# EasyEDA schematic SCH_CentralkaPawela-1.3_2025-06-29.json
TITLE: Sheet_1; REV: 1.0; Date: 2024-12-18; Sheet: 1/1; Drawn By: MarcinanBarbarzynca; Company: Your Company
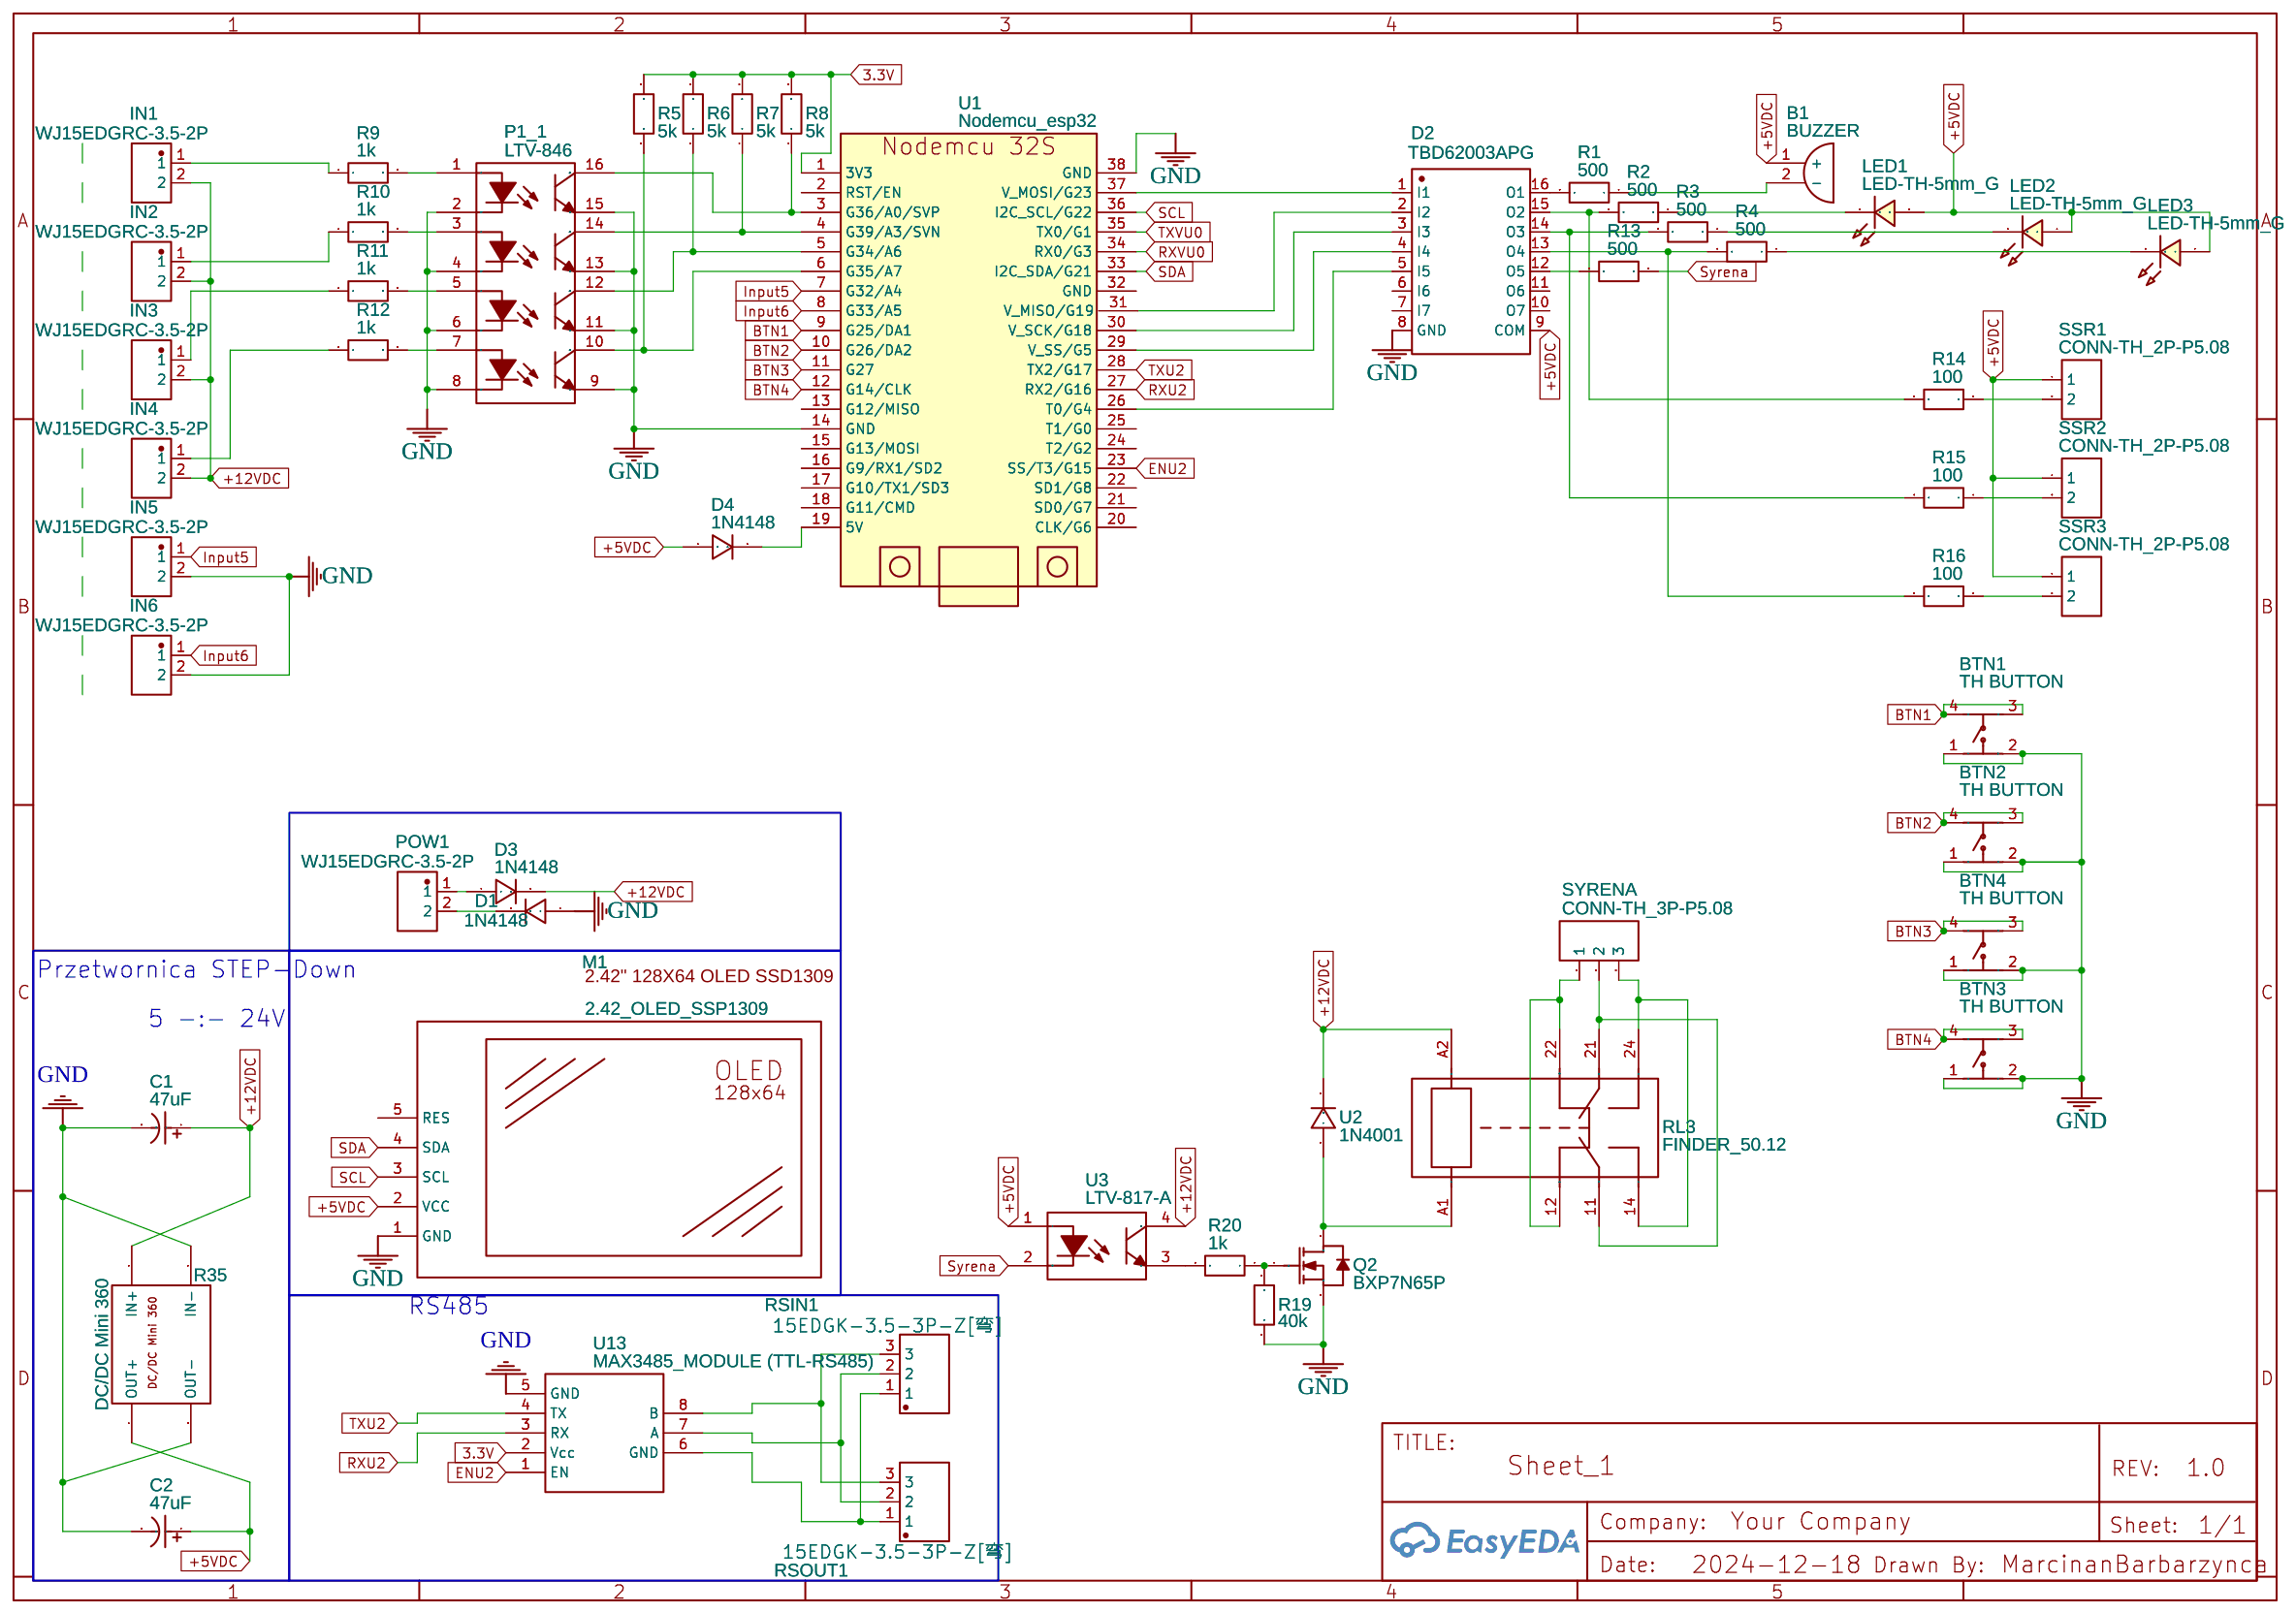
[diagram p0: schematic sheet]

## Parts
B1  BUZZER  [BUZZER]
BTN1  TH BUTTON  [KEY-TH_4P-L6.0-W6.0-P4.50-LS7.5]
BTN2  TH BUTTON  [KEY-TH_4P-L6.0-W6.0-P4.50-LS7.5]
BTN3  TH BUTTON  [KEY-TH_4P-L6.0-W6.0-P4.50-LS7.5]
BTN4  TH BUTTON  [KEY-TH_4P-L6.0-W6.0-P4.50-LS7.5]
C1  47uF  [CAP-D5.0XF2.0]
C2  47uF  [CAP-D5.0XF2.0]
D1  1N4148  [DO-35_BD2.0-L4.0-P8.00-D0.5-FD]
D2  TBD62003APG  [DIP-16_L19.8-W6.5-P2.54-LS7.6-BL]
D3  1N4148  [DO-35_BD2.0-L4.0-P8.00-D0.5-FD]
D4  1N4148  [DO-35_BD2.0-L4.0-P8.00-D0.5-FD]
IN1  WJ15EDGRC-3.5-2P  [CONN-TH_2P-P3.50_WJ15EDGRC-3.5-2P]
IN2  WJ15EDGRC-3.5-2P  [CONN-TH_2P-P3.50_WJ15EDGRC-3.5-2P]
IN3  WJ15EDGRC-3.5-2P  [CONN-TH_2P-P3.50_WJ15EDGRC-3.5-2P]
IN4  WJ15EDGRC-3.5-2P  [CONN-TH_2P-P3.50_WJ15EDGRC-3.5-2P]
IN5  WJ15EDGRC-3.5-2P  [CONN-TH_2P-P3.50_WJ15EDGRC-3.5-2P]
IN6  WJ15EDGRC-3.5-2P  [CONN-TH_2P-P3.50_WJ15EDGRC-3.5-2P]
LED1  LED-TH-5mm_G  [LED-TH_BD5.0_GREEN]
LED2  LED-TH-5mm_G  [LED-TH_BD5.0_GREEN]
LED3  LED-TH-5mm_G  [LED-TH_BD5.0_GREEN]
M1  2.42_OLED_SSP1309  [2.42_OLED_SSD1309]
P1_1  LTV-846  [DIP-16_16P-L20.2-W6.6-P2.54-LS7.6-BL]
POW1  WJ15EDGRC-3.5-2P  [CONN-TH_2P-P3.50_WJ15EDGRC-3.5-2P]
Q2  BXP7N65P  [PG-TO220-3_L10.0-W4.5-P2.54-L]
R1  500  [R_AXIAL-0.3]
R2  500  [R_AXIAL-0.3]
R3  500  [R_AXIAL-0.3]
R4  500  [R_AXIAL-0.3]
R5  5k  [R_AXIAL-0.3]
R6  5k  [R_AXIAL-0.3]
R7  5k  [R_AXIAL-0.3]
R8  5k  [R_AXIAL-0.3]
R9  1k  [R_AXIAL-0.3]
R10  1k  [R_AXIAL-0.3]
R11  1k  [R_AXIAL-0.3]
R12  1k  [R_AXIAL-0.3]
R13  500  [R_AXIAL-0.3]
R14  100  [R_AXIAL-0.3]
R15  100  [R_AXIAL-0.3]
R16  100  [R_AXIAL-0.3]
R19  40k  [R_AXIAL-0.3]
R20  1k  [R_AXIAL-0.3]
R35  DC/DC Mini 360  [DC/DC MINI 360]
RL3  FINDER_50.12  [FINDER-40.52]
RSIN1  15EDGK-3.5-3P-Z[弯]  [CONN-TH_3P-P3.50_WJ15EDGRC-3.5-3P-14-00A]
RSOUT1  15EDGK-3.5-3P-Z[弯]  [CONN-TH_3P-P3.50_WJ15EDGRC-3.5-3P-14-00A]
SSR1  CONN-TH_2P-P5.08  [CONN-TH_2P-P5.08]
SSR2  CONN-TH_2P-P5.08  [CONN-TH_2P-P5.08]
SSR3  CONN-TH_2P-P5.08  [CONN-TH_2P-P5.08]
SYRENA  CONN-TH_3P-P5.08  [CONN-TH_3P-P5.08]
U1  Nodemcu_esp32  [NODEMCU-ESP32S]
U2  1N4001  [DO-41_BD2.6-L5.1-P9.00-D0.8-RD]
U3  LTV-817-A  [DIP-4_L4.6-W6.5-P2.54-LS7.6-BL]
U13  MAX3485_MODULE (TTL-RS485)  [MAX3485_MODULE (TTL-RS485)]

## Library data of the parts
B1 = BUZZER: Buzzer; sourceId: 6mRnFXf9r; Contributor: Setthaphan
BTN1-BTN4 = TH BUTTON: Supplier Part: C59982; Supplier: LCSC; Manufacturer: ReliaPro; Manufacturer Part: button6*6*8; JLCPCB Part Class: Extended Part
C1 C2 = 47uF 16V Aluminum electrolytic capacitors: Supplier: LCSC; Manufacturer: ValuePro; Supplier Part: C22320
D1 D3 D4 = 1N4148: Supplier: LCSC; Manufacturer: SEMTECH; Supplier Part: C14516; Contributor: LCEDA_Lib
D2 = TBD62003APG: Supplier: LCSC; Manufacturer: TOSHIBA; Contributor: LCSC; Supplier Part: C146373
IN1-IN6 POW1 = WJ15EDGRC-3.5-2P: Contributor: LCSC; Supplier: LCSC; Supplier Part: C2924837; Manufacturer: KANGNEX(康奈克斯电气); JLCPCB Part Class: Extended Part
LED1-LED3 = LED-TH-5mm_G: Manufacturer: EVERLIGHT(台湾亿光); Manufacturer Part: 333-2SYGD/S530-E2; Supplier Part: C88163; Supplier: LCSC; Contributor: LCEDA_Lib
M1 = 2.42_OLED_SSP1309: Supplier: Nettigo; Contributor: Lberquez
P1_1 = LTV-846: Supplier: LCSC; Manufacturer: LITEON; Supplier Part: C10793
Q2 = IPP60R385CP: Contributor: LCSC; Supplier: LCSC; Supplier Part: C537223; Manufacturer: Infineon(英飞凌); JLCPCB Part Class: Extended Part
R1-R16 R19 R20 = R_AXIAL-0.3_EU: Contributor: LCEDA_Lib
R35 = DC/DC Mini 360: Contributor: marcos.asael2
RL3 = FINDER_40.52.7.012.0000: Manufacturer Part: New SchematicLib; Contributor: jlam123; Supplier Part: 40.61.7.012.0000; Supplier: Pollin; link: https://www.pollin.de/p/relais-finder-40-61-7-012-0000-340678
RSIN1 RSOUT1 = 15EDGK-3.5-3P-Z[弯]: Contributor: LCSC; Supplier: LCSC; Supplier Part: C9900003720; Manufacturer: null; JLCPCB Part Class: Extended Part
SSR1-SSR3 = CONN-TH_2P-P5.08: Supplier: LCSC; Contributor: LCEDA_Lib
SYRENA = CONN-TH_3P-P5.08: Supplier: LCSC; Contributor: LCEDA_Lib
U1 = Nodemcu_esp32: Manufacturer Part: Nodemcu esp32; Contributor: Pietro Dona
U2 = 1N4001_C237252: Contributor: lcsc; Supplier: LCSC; Supplier Part: C237252; Manufacturer: HL(豪林); JLCPCB Part Class: Extended Part
U3 = LTV-817-A: Supplier: LCSC; Manufacturer: LITEON(光宝); Supplier Part: C62715; JLCPCB Part Class: Extended Part
U13 = MAX3485_MODULE (TTL-RS485): Supplier: Aliexpress; link: https://es.aliexpress.com/item/1005001579669576.html; Contributor: txankete

## Nets
3.3V: R5.2 R6.2 R7.2 R8.2 U1.1(3V3) U13.2(Vcc)
+5VDC: B1.1(+) C2.1 D2.9(COM) D4.1 LED1.1 LED2.1 LED3.1 M1.2(VCC) R35.4(OUT+) SSR1.1 SSR2.1 SSR3.1 U3.1(AN)
+12VDC: C1.1 D3.2 IN1.2 IN2.2 IN3.2 IN4.2 R35.1(IN+) RL3.A2 U2.1(C) U3.4(COL)
GND: BTN1.1 BTN1.2 BTN2.1 BTN2.2 BTN3.1 BTN3.2 BTN4.1 BTN4.2 C1.2 C2.2 D1.1 D2.8(GND) IN5.2 IN6.2 M1.1(GND) P1_1.2(CAT) P1_1.4(CAT) P1_1.6(CAT) P1_1.8(CAT) P1_1.9(EM) P1_1.11(EM) P1_1.13(EM) P1_1.15(EM) Q2.3(S) R19.2 R35.2(IN-) R35.3(OUT-) U1.14(GND) U1.38(GND) U13.5(GND)
BTN1: BTN1.3 BTN1.4 U1.9(G25/DA1)
BTN2: BTN2.3 BTN2.4 U1.10(G26/DA2)
BTN3: BTN4.3 BTN4.4 U1.11(G27)
BTN4: BTN3.3 BTN3.4 U1.12(G14/CLK)
ENU2: U1.23(SS/T3/G15) U13.1(EN)
Input5: IN5.1 U1.7(G32/A4)
Input6: IN6.1 U1.8(G33/A5)
RXU2: U1.27(RX2/G16) U13.3(RX)
RXVU0: U1.34(RX0/G3)
SCL: M1.3(SCL) U1.36(I2C SCL/G22)
SDA: M1.4(SDA) U1.33(I2C SDA/G21)
Syrena: R13.1 U3.2(CAT)
TXU2: U1.28(TX2/G17) U13.4(TX)
TXVU0: U1.35(TX0/G1)
Net-(B1-2): B1.2(-) R1.1
Net-(D1-2): D1.2 POW1.2
Net-(D2-1): D2.1(I1) U1.37(V_MOSI/G23)
Net-(D2-2): D2.2(I2) U1.31(V_MISO/G19)
Net-(D2-3): D2.3(I3) U1.30(V_SCK/G18)
Net-(D2-4): D2.4(I4) U1.29(V_SS/G5)
Net-(D2-5): D2.5(I5) U1.26(T0/G4)
Net-(D2-12): D2.12(O5) R13.2
Net-(D2-13): D2.13(O4) R4.2 R16.2
Net-(D2-14): D2.14(O3) R3.2 R15.2
Net-(D2-15): D2.15(O2) R2.2 R14.2
Net-(D2-16): D2.16(O1) R1.2
Net-(D3-1): D3.1 POW1.1
Net-(D4-2): D4.2 U1.19(5V)
Net-(IN1-1): IN1.1 R9.1
Net-(IN2-1): IN2.1 R10.1
Net-(IN3-1): IN3.1 R11.1
Net-(IN4-1): IN4.1 R12.1
Net-(LED1-2): LED1.2 R2.1
Net-(LED2-2): LED2.2 R3.1
Net-(LED3-2): LED3.2 R4.1
Net-(P1_1-1): P1_1.1(AN) R9.2
Net-(P1_1-3): P1_1.3(AN) R10.2
Net-(P1_1-5): P1_1.5(AN) R11.2
Net-(P1_1-7): P1_1.7(AN) R12.2
Net-(P1_1-10): P1_1.10(COL) R5.1 U1.6(G35/A7)
Net-(P1_1-12): P1_1.12(COL) R6.1 U1.5(G34/A6)
Net-(P1_1-14): P1_1.14(COL) R7.1 U1.4(G39/A3/SVN)
Net-(P1_1-16): P1_1.16(COL) R8.1 U1.3(G36/A0/SVP)
Net-(Q2-1): Q2.1(G) R19.1 R20.1
Net-(Q2-2): Q2.2(D) RL3.A1 U2.2(A)
Net-(R14-1): R14.1 SSR1.2
Net-(R15-1): R15.1 SSR2.2
Net-(R16-1): R16.1 SSR3.2
Net-(R20-2): R20.2 U3.3(EM)
Net-(RL3-11): RL3.11 RL3.21 SYRENA.2
Net-(RL3-12): RL3.12 RL3.22 SYRENA.1
Net-(RL3-14): RL3.14 RL3.24 SYRENA.3
Net-(RSIN1-1): RSIN1.1 RSOUT1.1 U13.6(GND)
Net-(RSIN1-2): RSIN1.2 RSOUT1.2 U13.7(A)
Net-(RSIN1-3): RSIN1.3 RSOUT1.3 U13.8(B)

Not connected (* = marked no-connect by the designer): D2 6(I6) 7(I7) 10(O7) 11(O6); M1 5(RES); U1 2(RST/EN) 13(G12/MISO) 15(G13/MOSI) 16(G9/RX1/SD2) 17(G10/TX1/SD3) 18(G11/CMD) 20(CLK/G6) 21(SD0/G7) 22(SD1/G8) 24(T2/G2) 25(T1/G0) 32(GND)

## Notes on the sheet
- Przetwornica STEP-Down
- 5 -:- 24V
- RS485
